# EAGLE design SparkFun_Differential_I2C_Breakout_PCA9615_Qwiic (EAGLE 9.6.0)
ABBREV: hb1; PROJECT: Heading Board
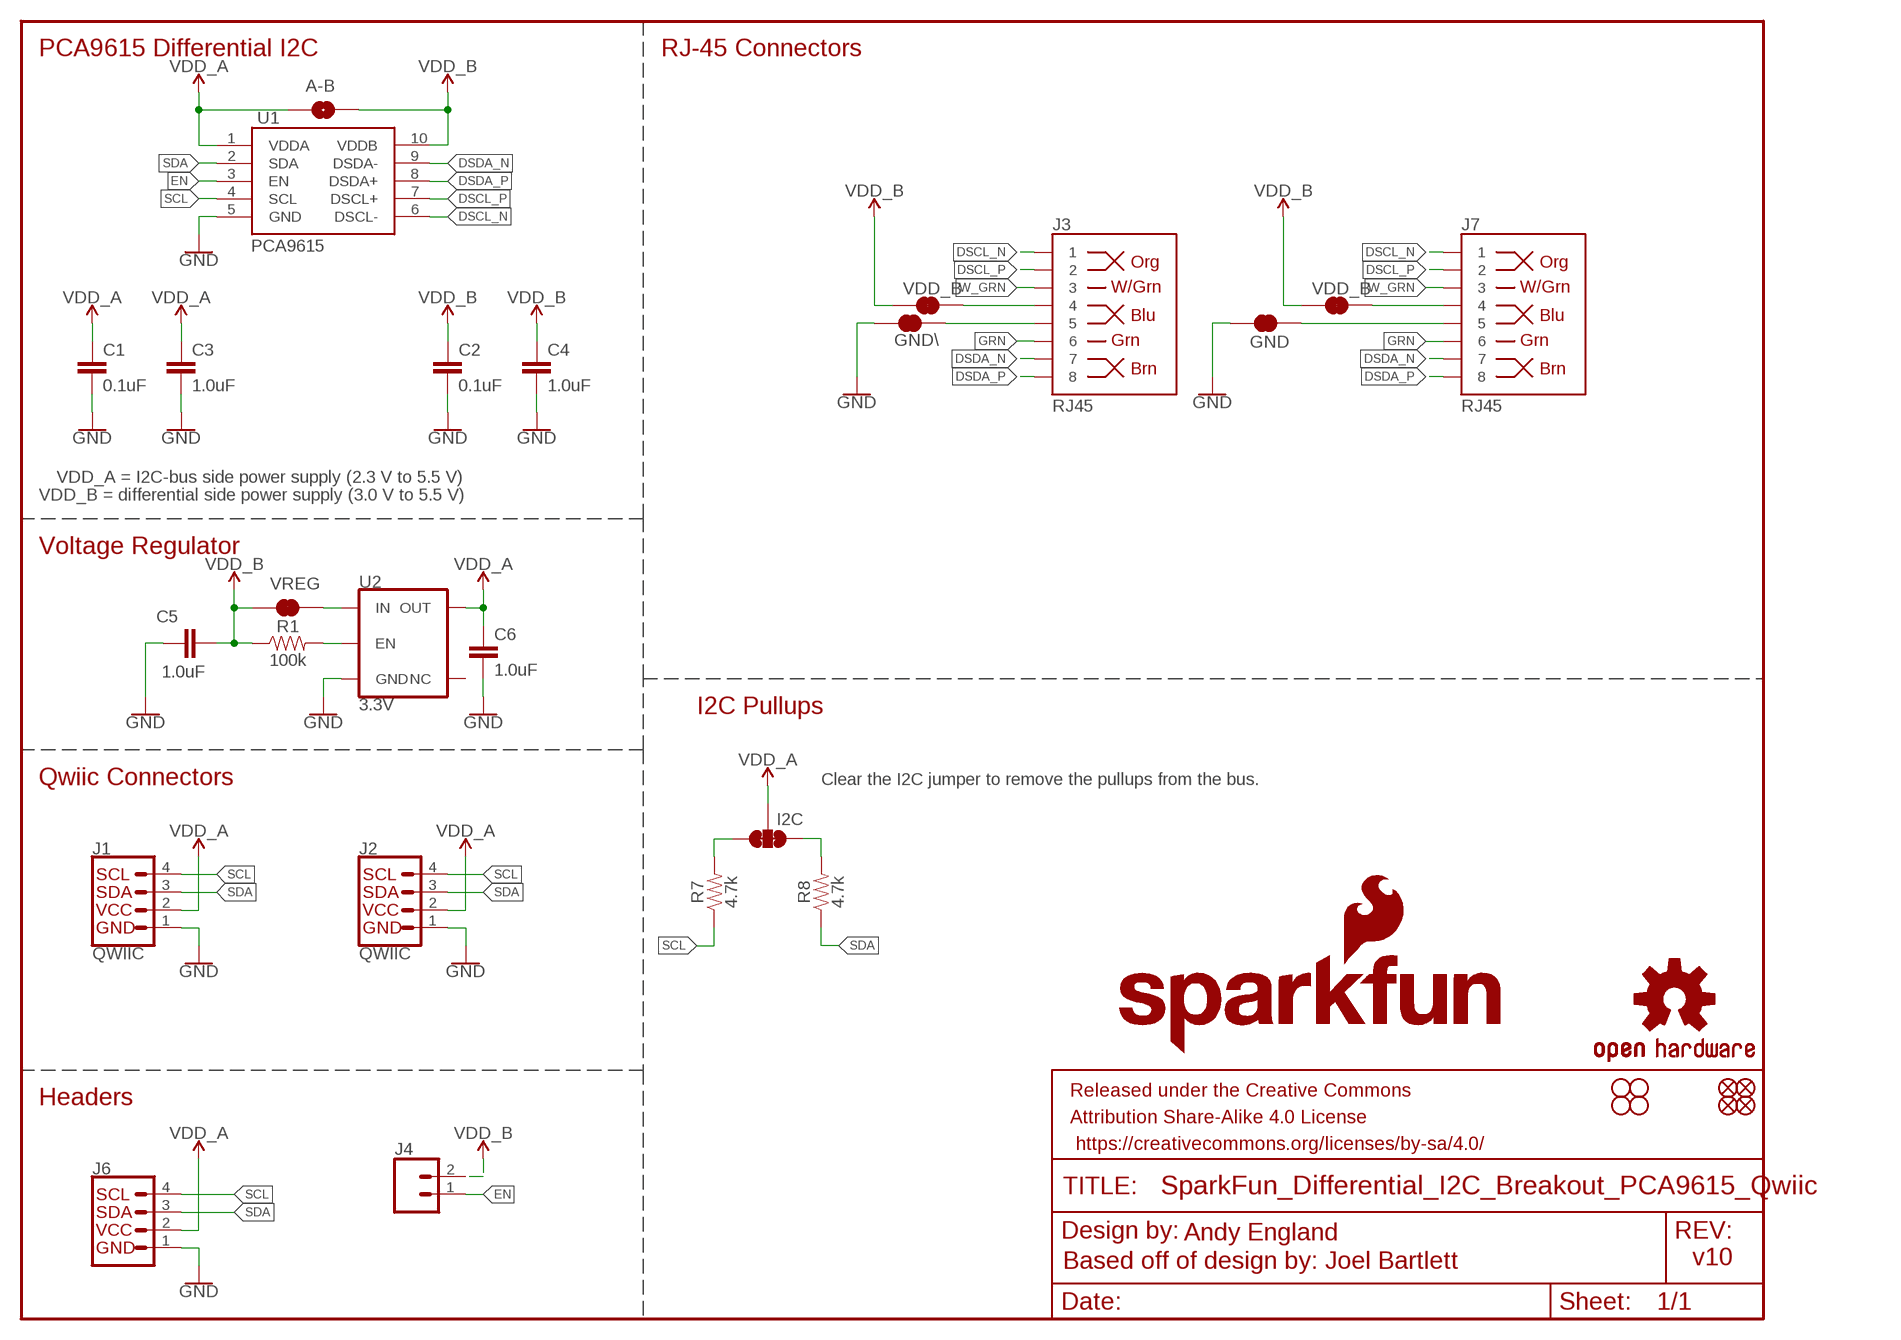
[diagram p0: schematic, sheet 1]

## Parts
A-B  JUMPER-SMT_2_NO_SILK  [SMT-JUMPER_2_NO_SILK]
C1  0.1uF  0.1UF-0603-25V-(+80/-20%)  [0603]
C2  0.1uF  0.1UF-0603-25V-(+80/-20%)  [0603]
C3  1.0uF  1.0UF-0603-16V-10%  [0603]
C4  1.0uF  1.0UF-0603-16V-10%  [0603]
C5  1.0uF  1.0UF-0603-16V-10%  [0603]
C6  1.0uF  1.0UF-0603-16V-10%  [0603]
FD1  FIDUCIALUFIDUCIAL  [FIDUCIAL-MICRO]
FD2  FIDUCIALUFIDUCIAL  [FIDUCIAL-MICRO]
FD3  FIDUCIALUFIDUCIAL  [FIDUCIAL-MICRO]
FD4  FIDUCIALUFIDUCIAL  [FIDUCIAL-MICRO]
FRAME1  FRAME-LETTER  [CREATIVE_COMMONS]
GND\  JUMPER-SMT_2_NC_TRACE_SILK  [SMT-JUMPER_2_NC_TRACE_SILK]
H1  STAND-OFF  [STAND-OFF]
H2  STAND-OFF  [STAND-OFF]
H3  STAND-OFF  [STAND-OFF]
H4  STAND-OFF  [STAND-OFF]
I2C  JUMPER-SMT_3_2-NC_TRACE_SILK  [SMT-JUMPER_3_2-NC_TRACE_SILK]
J1  QWIIC  QWIIC_CONNECTORJS-1MM  [JST04_1MM_RA]
J2  QWIIC  QWIIC_CONNECTORJS-1MM  [JST04_1MM_RA]
J3  RJ45  RJ45-8  [RJ45-8]
J4  CONN_021X02_NO_SILK  [1X02_NO_SILK]
J6  I2C_STANDARD_NO_SILK  [1X04_NO_SILK]
J7  RJ45  RJ45-8  [RJ45-8]
JP5  JUMPER-SMT_2_NC_TRACE_SILK  [SMT-JUMPER_2_NC_TRACE_SILK]
JP6  JUMPER-SMT_2_NC_TRACE_SILK  [SMT-JUMPER_2_NC_TRACE_SILK]
LOGO1  OSHW-LOGOM  [OSHW-LOGO-M]
LOGO5  SFE_LOGO_NAME_FLAME.1_INCH  [SFE_LOGO_NAME_FLAME_.1]
R1  100k  100KOHM-0603-1/10W-1%  [0603]
R7  4.7k  4.7KOHM-0603-1/10W-1%  [0603]
R8  4.7k  4.7KOHM-0603-1/10W-1%  [0603]
U1  PCA9615  [TSSOP10]
U2  3.3V  V_REG_AP2112K-3.3V  [SOT23-5]
VDD_B  JUMPER-SMT_2_NC_TRACE_SILK  [SMT-JUMPER_2_NC_TRACE_SILK]
VREG  JUMPER-SMT_2_NC_TRACE_SILK  [SMT-JUMPER_2_NC_TRACE_SILK]

## Nets
DSCL_N: J3.1 J7.1 U1.6(DSCL-)
DSCL_P: J3.2 J7.2 U1.7(DSCL+)
DSDA_N: J3.7 J7.7 U1.9(DSDA-)
DSDA_P: J3.8 J7.8 U1.8(DSDA+)
EN: J4.1 U1.3(EN)
GND: C1.2 C2.2 C3.2 C4.2 C5.1 C6.2 GND\.1 J1.1 J2.1 J6.1(GND) JP6.1 U1.5(GND) U2.2(GND)
GRN: J3.6 J7.6
N$1: J3.4 VDD_B.2
N$2: GND\.2 J3.5
N$3: I2C.1 R8.2
N$4: I2C.3 R7.2
N$5: J7.4 JP5.2
N$6: J7.5 JP6.2
N$7: R1.2 U2.3(EN)
N$8: U2.1(IN) VREG.2
SCL: J1.4 J2.4 J6.4(SCL) R7.1 U1.4(SCL)
SDA: J1.3 J2.3 J6.3(SDA) R8.1 U1.2(SDA)
VDD_A: A-B.1 C1.1 C3.1 C6.1 I2C.2 J1.2 J2.2 J6.2(VCC) U1.1(VDDA) U2.5(OUT)
VDD_B: A-B.2 C2.1 C4.1 C5.2 J4.2 JP5.1 R1.1 U1.10(VDDB) VDD_B.1 VREG.1
W_GRN: J3.3 J7.3
Unconnected: U2.4(NC)

## Notes on the sheet
- PCA9615 Differential I2C | RJ-45 Connectors
- VDD_B
- GND
- VDD_A = I2C-bus side power supply (2.3 V to 5.5 V)
- VDD_B = differential side power supply (3.0 V to 5.5 V)
- Voltage Regulator
- I2C Pullups
- Qwiic Connectors | Clear the I2C jumper to remove the pullups from the bus.
- Headers
- Andy England
- Based off of design by: Joel Bartlett | v10

## Library data of the parts
A-B = SparkFun-Jumpers:JUMPER-SMT_2_NO: Normally open jumper This jumper has two pads in close proximity to each other. Apply solder to close the connection. Round pads are easier to solder for beginners, but are a lot larger. SparkFun Product that uses the round pads: SparkFun EL Sequencer <https://www.sparkfun.com/products/12781>
C1 C2 = SparkFun-Capacitors:0.1UF: 0.1µF ceramic capacitors A capacitor is a passive two-terminal electrical component used to store electrical energy temporarily in an electric field.; PROD_ID: CAP-00810
C3-C6 = SparkFun-Capacitors:1.0UF: 1µF ceramic capacitors A capacitor is a passive two-terminal electrical component used to store electrical energy temporarily in an electric field.; PROD_ID: CAP-00868
FD1-FD4 = SparkFun-Aesthetics:FIDUCIAL: Fiducial Alignment Points Point-of-reference for pick-and-place machines and other optical instruments.
FRAME1 = SparkFun-Aesthetics:FRAME-LETTER: Schematic Frame - Letter Standard 8.5x11 US Letter frame
GND\ JP5 JP6 VDD_B VREG = SparkFun-Jumpers:JUMPER-SMT_2_NC_TRACE: Normally closed trace jumper This jumper has a trace between two pads so it's normally closed (NC). Use a razor knife to open the connection. For best results follow the IPC guidelines for cutting traces: Cutout at least 0.063 mm (0.005 in). Remove all loose material to clean up the cut area. Seal the cut with an approved epoxy. Reapply solder to reclose the connection.
H1-H4 = SparkFun-Hardware:STAND-OFF: Stand Off Drill holes for mechanically mounting via screws, standoffs, etc. Note: Use the keepout ring to avoid running the screw head into surrounding components. Variant Overviews STAND-OFF - Mechanical footprint for a #4 phillips button head screw. STAND-OFF-TIGHT - Mechanical footprint for a #4 phillips button head screw, Example SparkFun Products Screw - Phillips Head (1/4", 4-40, 10 pack) <https://www.sparkfun.com/products/10453> (PRT-10453) Screw - Phillips Head (1/2", 4-40, 10 pack) <https://www.sparkfun.com/products/10452> (PRT-10452) Screw - Phillips Head (3/4", 4-40, 10 pack) <https://www.sparkfun.com/products/10451> (PRT-10451) Screw - Phillips Head (1", 4-40, 10 pack) <https://www.sparkfun.com/products/10450> (PRT-10450)
I2C = SparkFun-Jumpers:JUMPER-SMT_3_2-NC_TRACE: Normally closed trace jumper (2 of 2 connections) This jumper has a trace between all three pads so they are normally closed (NC). Use a razor knife to open the connection(s). For best results follow the IPC guidelines for cutting traces: Cutout at least 0.063 mm (0.005 in). Remove all loose material to clean up the cut area. Seal the cut with an approved epoxy. Reapply solder to reclose the connection(s).
J1 J2 = SparkFun-Connectors:QWIIC_CONNECTOR: SparkFun I2C Standard Qwiic Connector An SMD 1mm pitch JST connector makes it easy and quick (get it? Qwiic?) to connect I2C devices to each other. The Qwiic system <http://www.sparkfun.com/qwiic> enables fast and solderless connection between popular platforms and various sensors and actuators. We carry 200mm <https://www.sparkfun.com/products/14204>, 100mm <https://www.sparkfun.com/products/14205>, 50mm <https://www.sparkfun.com/products/14206>, and breadboard friendly <https://www.sparkfun.com/products/14207> Qwiic cables. We also offer 10 pcs strips <https://www.sparkfun.com/products/14323> the SMD connectors.; PROD_ID: CONN-13694; VALUE: QWIIC_RIGHT_ANGLE
J3 J7 = SparkFun-Connectors:RJ45-8: RJ45 Jack - 8 pin Simple RJ45, 8-pin connection. Commonly used for Cat5, Cat5e, and Cat6 Ethernet cables. Here is the connector we sell at SparkFun: RJ45 8-Pin Connector <https://www.sparkfun.com/products/643> (PRT-00643) Datasheet <https://cdn.sparkfun.com/datasheets/Prototyping/04908.pdf> It is used on this SparkFun product: SparkFun RJ45 Breakout <https://www.sparkfun.com/products/716> (BOB-00716) Note, you may also be interested in the "MAGJACK" version of this. It is basically a RJ45 connector, but also has some status LEDs built into the connector housing. You can check that out in this library at the device named "MAGJACK.dev" and see these products online: RJ45 Ethernet MagJack-Compatible <https://www.sparkfun.com/products/8534> (PRT-08534) SparkFun RJ45 MagJack Breakout <https://www.sparkfun.com/products/13021> (BOB-13021); PROD_ID: CONN-08506; SF_ID: PRT-00643
J4 = SparkFun-Connectors:CONN_02: Multi connection point. Often used as Generic Header-pin footprint for 0.1 inch spaced/style header connections On any of the 0.1 inch spaced packages, you can populate with these: Break Away Headers - Straight <https://www.sparkfun.com/products/116> (PRT-00116) Break Away Male Headers - Right Angle <https://www.sparkfun.com/products/553> (PRT-00553) Female Headers <https://www.sparkfun.com/products/115> (PRT-00115) Break Away Headers - Machine Pin <https://www.sparkfun.com/products/117> (PRT-00117) Break Away Female Headers - Swiss Machine Pin <https://www.sparkfun.com/products/743> (PRT-00743) For SCREWTERMINALS and SPRING TERMINALS visit here: Screw Terimnals on SparkFun.com <https://www.sparkfun.com/search/results?term=Screw+Terminals> (5mm/3.5mm/2.54mm spacing) This device is also useful as a general connection point to wire up your design to another part of your project. Our various solder wires solder well into these plated through hole pads. Hook-Up Wire - Assortment (Stranded, 22 AWG) <https://www.sparkfun.com/products/11375> (PRT-11375) Hook-Up Wire - Assortment (Solid Core, 22 AWG) <https://www.sparkfun.com/products/11367> (PRT-11367) View the entire wire category on our website here <https://www.sparkfun.com/categories/141> Special notes: Molex polarized connector foot print use with: PRT-08233 with associated crimp pins and housings. 2.54_SCREWTERM for use with PRT-10571. 3.5mm Screw Terminal footprints for PRT-08084 5mm Screw Terminal footprints for use with PRT-08432
J6 = SparkX:I2C_STANDARD: SparkFun I2C Standard Pinout Header SparkFun has standardized on a pinout for all I2C based sensor breakouts. This pinout allows I2C boards to be plugged directly into the headers on Arduino Uno compatible boards, and to be daisy chained easily. Example SparkFun Products: SparkFun Atmospheric Sensor Breakout - BME280 <https://www.sparkfun.com/products/13676> SparkFun Altitude/Pressure Sensor Breakout - MPL3115A2 <https://www.sparkfun.com/products/11084> SparkFun TOF Range Finder Sensor - VL6180 <https://www.sparkfun.com/products/12785>
LOGO1 = SparkFun-Aesthetics:OSHW-LOGO: Open-Source Hardware (OSHW) Logo This logo indicates the piece of hardware it is found on incorporates a OSHW license and/or adheres to the definition of open source hardware found here: http://freedomdefined.org/OSHW
LOGO5 = SparkFun-Aesthetics:SFE_LOGO_NAME_FLAME: SparkFun Font Logo w/ Flame This is the SparkFun full logo. The logo on the schematic will always be the same size; the package variant is the height of the flame part of the logo. Default layer for the logo on the board is tSilk.
R1 = SparkFun-Resistors:100KOHM: 100kΩ resistor A resistor is a passive two-terminal electrical component that implements electrical resistance as a circuit element. Resistors act to reduce current flow, and, at the same time, act to lower voltage levels within circuits. - Wikipedia; PROD_ID: RES-07828
R7 R8 = SparkFun-Resistors:4.7KOHM: 4.7kΩ resistor A resistor is a passive two-terminal electrical component that implements electrical resistance as a circuit element. Resistors act to reduce current flow, and, at the same time, act to lower voltage levels within circuits. - Wikipedia; PROD_ID: RES-07857
U1 = SparkFun-IC-Comms:PCA9615: Differential I2C Bus Buffer Datasheet <https://www.nxp.com/docs/en/data-sheet/PCA9615.pdf>; PROD_ID: IC-13899
U2 = SparkFun-IC-Power:V_REG_AP2112: AP2112 - 600mA CMOS LDO Regulator w/ Enable The AP2112 is CMOS process low dropout linear regulator with enable function, the regulator delivers a guaranteed 600mA (min.) continuous load current. Features Output Voltage Accuracy: ±1.5% Output Current: 600mA (Min.) Foldback Short Current Protection: 50mA Enable Function to Turn ON/OFF VOUT Low Dropout Voltage (3.3V): 250mV (Typ.) @IOUT=600mA Excellent Load Regulation: 0.2%/A (Typ.) Excellent Line Regulation: 0.02%/V (Typ.) Low Quiescent Current: 55μA (Typ.) Low Standby Current: 0.01μA (Typ.) Low Output Noise: 50μVRMS PSRR: 100Hz -65dB, 1kHz -65dB OTSD Protection Stable with 1.0μF Flexible Cap: Ceramic, Tantalum and Aluminum Electrolytic Operation Temperature Range: -40°C to 85°C ESD: MM 400V, HBM 4000V; PROD_ID: VREG-12457

## Net classes
0 default: width 0.203 mm
1 power: width 0.381 mm, clearance 0.254 mm

## Board
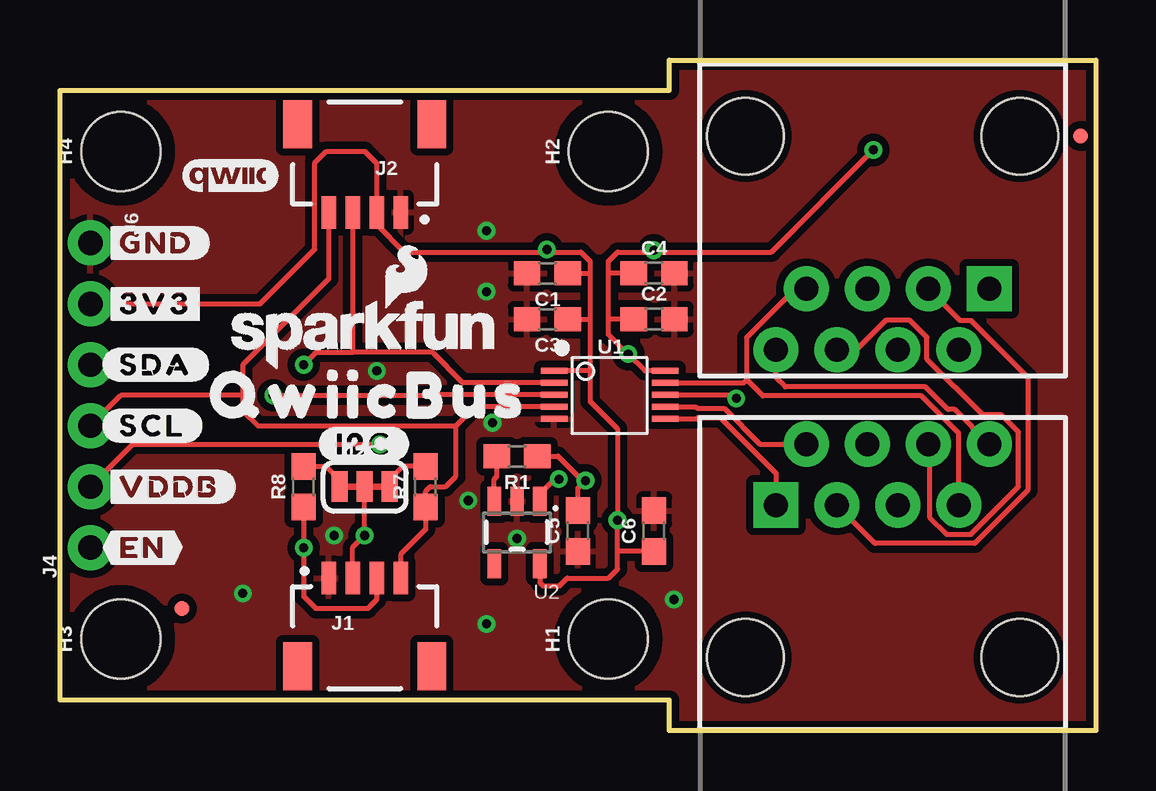
[diagram p1: board, top side]
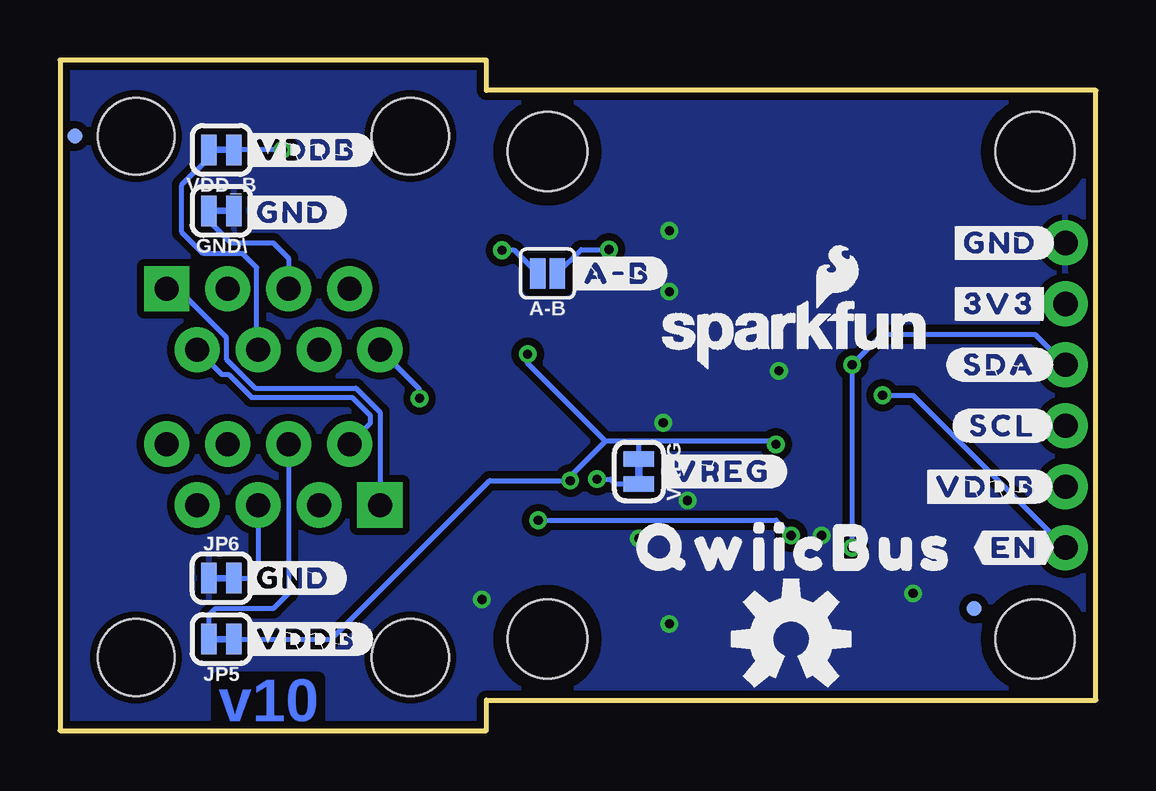
[diagram p2: board, bottom side, seen from below]

Size 43.18 x 27.94 mm. Coordinates in mm from the lower left corner, seen from the top.
Outline: 43.18,0 25.4,0 25.4,1.27 0,1.27 0,26.67 25.4,26.67 25.4,27.94 43.18,27.94 43.18,0
Copper layers (1*16): Top 0.035mm / dielectric 1.5mm / Bottom 0.035mm
Design rules "SparkFun-2-layer-TIGHT": minimum track width 7mil, minimum drill 15mil, track to track 7mil, track to pad 7mil, pad to pad 7mil, via to via 7mil, smd to smd 7mil, copper to edge 7mil, drill to drill 7mil, minimum pad ring 7mil, minimum via ring 7mil, stop-mask expansion 4mil, vias tented up to drill 25mil, thermal gap 10mil

### Footprints (pad centres in the part's own frame; a part is rotated, then mirrored left to right if it is on the bottom)
SMT-JUMPER_2_NO_SILK = smd 0.635 x 1.27: 1 -0.406,0; 2 0.406,0
0603 = smd 1.1 x 1: 1 -0.85,0; 2 0.85,0
FIDUCIAL-MICRO = smd 0.635 x 0.635: 1 0,0
SMT-JUMPER_2_NC_TRACE_SILK = smd 0.66 x 1.27: 1 -0.521,0; 2 0.521,0
STAND-OFF = hole 3.302: 0,0
SMT-JUMPER_3_2-NC_TRACE_SILK = smd 0.66 x 1.27: 1 -1.041,0; 2 0,0; 3 1.041,0
JST04_1MM_RA = smd 0.6 x 1.35: 1 -1.5,0; 2 -0.5,0; 3 0.5,0; 4 1.5,0 | smd 1.2 x 2: NC1 2.8,-3.675; NC2 -2.8,-3.675
RJ45-8 = drill 1 pad 1.88 square: 1 -4.445,6.35 | drill 1 pad 1.88: 2 -3.175,8.89; 3 -1.905,6.35; 4 -0.635,8.89; 5 0.635,6.35; 6 1.905,8.89; 7 3.175,6.35; 8 4.445,8.89 | hole 3.2: -5.715,0; 5.715,0
1X02_NO_SILK = drill 1.016 pad 1.88: 1 0,0; 2 2.54,0
1X04_NO_SILK = drill 1.016 pad 1.88: 1 0,0; 2 2.54,0; 3 5.08,0; 4 7.62,0
TSSOP10 = smd 1.1 x 0.25: 1 -2.259,1.018; 2 -2.259,0.517; 3 -2.259,0.018; 4 -2.259,-0.482; 5 -2.259,-0.988; 6 2.366,-0.988; 7 2.366,-0.482; 8 2.366,0.018; 9 2.366,0.517; 10 2.366,1.018
SOT23-5 = smd 0.55 x 1.2: 1 -0.95,-1.3; 2 0,-1.3; 3 0.95,-1.3; 4 0.95,1.3; 5 -0.95,1.3

### Placement (x,y rotation side)
A-B  22.86,19.05 180 bottom
C1  20.32,19.05 180 top
C2  24.77,17.14 0 top
C3  20.32,17.14 180 top
C4  24.77,19.05 0 top
C5  21.59,8.32 90 top
C6  24.77,8.32 90 top
FD1  5.08,5.08 0 top
FD2  42.55,24.77 0 top
FD3  5.08,5.08 0 bottom
FD4  42.55,24.77 0 bottom
FRAME1  -16.51,-15.24 0 top  (outside the outline)
GND\  36.45,21.65 180 bottom
H1  22.86,3.81 90 top
H2  22.86,24.13 90 top
H3  2.54,3.81 90 top
H4  2.54,24.13 90 top
I2C  12.7,10.16 0 top
J1  12.7,6.35 0 top
J2  12.7,21.59 180 top
J3  34.29,24.77 180 top
J4  1.27,7.62 90 top
J6  1.27,20.32 270 top
J7  34.29,3.05 0 top
JP5  36.45,3.81 180 bottom
JP6  36.45,6.35 0 bottom
LOGO1  12.7,3.81 0 bottom
LOGO2  SFE_LOGO_NAME_FLAME.1_INCH  [SFE_LOGO_NAME_FLAME_.1]  12.51,16.51 0 bottom
LOGO5  12.7,16.51 0 top
R1  19.05,11.43 180 top
R7  15.24,10.16 90 top
R8  10.16,10.16 90 top
U1  22.86,13.97 0 top
U2  19.05,8.26 180 top
U$1  [#GND#0]  1.78,20.32 0 top
U$2  [#3V3#0]  1.78,17.78 0 top
U$3  [#SDA#0]  1.78,15.24 0 top
U$4  [#SCL#0]  1.78,12.7 0 top
U$5  [#VDDB#0]  7.37,10.16 0 bottom
U$6  [#EN#0]  1.78,7.62 0 top
U$7  [#GND#0]  6.22,20.32 0 bottom
U$8  [#3V3#0]  6.22,17.78 0 bottom
U$9  [#SDA#0]  6.22,15.24 0 bottom
U$10  [#SCL#0]  5.97,12.7 0 bottom
U$11  [#A#B#0]  22.03,19.05 0 bottom
U$12  [#EN#0]  5.08,7.62 0 bottom
U$13  [#I2C#0]  10.79,11.94 0 top
U$14  [QWIICBUS0]  4.83,13.97 0 top
U$15  [QWIICBUS0]  20.57,7.62 0 bottom
U$16  [#VDDB#0]  1.78,10.16 0 top
U$17  [#VREG#0]  18.35,10.79 0 bottom
U$18  [#VDDB#0]  35.69,24.19 0 bottom
U$19  [#VDDB#0]  35.69,3.81 0 bottom
U$20  [#GND#0]  35.69,6.35 0 bottom
U$21  [#GND#0]  35.69,21.59 0 bottom
U$22  [QWIIC_4MM]  7.11,23.11 0 top
VDD_B  36.45,24.19 180 bottom
VREG  19.05,10.79 270 bottom

### Tracks (layer width: path | path; a pad name or v marks a point on that pad's centre or on a via)
DSCL_N
  Top 0.203: J7.1 29.84,10.73 27.54,13.04 26.57,13.04 26.52,12.98 U1.6
  Bottom 0.203: J7.1 29.84,13.27 30.84,14.27 35.04,14.27 36.25,15.47 36.25,16.38 38.28,18.41 J3.1
DSCL_P
  Top 0.203: J7.2 29.18,11.94 27.69,13.42 26.57,13.42 26.51,13.49 U1.7
  Bottom 0.203: J7.2 30.25,12.81 30.25,13.13 31,13.88 35.2,13.88 36.16,14.84 36.43,14.84 J3.2
DSDA_N
  Top 0.203: J3.7 30.66,18.41 28.63,16.38 28.63,14.62 | 28.63,14.62 29.3,13.94 35.91,13.94 37.47,12.39 J7.7 | U1.9 28.5,14.49 28.63,14.62
DSDA_P  (via drill 0.38)
  Top 0.203: J3.8 29.84,14.71 30.23,14.32 36.07,14.32 37.02,13.38 37.29,13.38 J7.8 | U1.8 28.04,13.99 v28.19,13.84
  Bottom 0.203: v28.19,13.84 28.19,14.22 J3.8
EN  (via drill 0.38)
  Top 0.203: U1.3 15.26,13.99 15.24,13.97 v8.89,13.97
  Bottom 0.203: v8.89,13.97 7.62,13.97 J4.1
GND  (via drill 0.38)
  other vias: 11.43,8.13 17.78,18.29 19.05,8 18.03,12.83 17.78,4.45 7.62,5.71 13.21,14.99 17.02,9.59 17.78,20.83 25.59,5.46
  pour Top (isolate 0.305): 43.18,0 25.4,0 25.4,1.27 0,1.27 0,26.67 25.4,26.67 25.4,27.94 43.18,27.94
  pour Bottom (isolate 0.305): 43.18,0 25.4,0 25.4,1.27 0,1.27 0,26.67 25.4,26.67 25.4,27.94 43.18,27.94
  pour Bottom (isolate 0.305): 43.18,0 25.4,0 25.4,1.27 0,1.27 0,26.67 25.4,26.67 25.4,27.94 43.18,27.94
GRN
  Top 0.203: J7.6 36.25,11.89 36.25,8.89 36.96,8.18 37.97,8.18 39.95,10.16 39.95,12.44 39.24,13.16 38.46,13.16 36.14,15.47 36.14,16.38 35.43,17.09 34.42,17.09 33.2,15.88 J3.6
N$1
  Bottom 0.203: J3.4 34.98,15.93 34.98,19.29 35.56,19.88 37.21,19.88 38.1,20.77 38.1,22.73 36.97,23.86 VDD_B.2
N$2
  Bottom 0.203: GND\.2 36.97,21.22 36.07,20.32 34.29,20.32 33.66,19.68 J3.5
N$3
  Top 0.203: R8.2 11.09,11.01 11.68,10.41 11.66,10.39 I2C.1
N$4
  Top 0.203: R7.2 14.31,11.01 13.72,10.41 13.74,10.39 I2C.3
N$5
  Bottom 0.203: J7.4 33.66,5.71 34.29,5.08 36.7,5.08 36.96,4.83 36.96,3.82 JP5.2
N$6
  Bottom 0.203: J7.5 34.92,6.73 35.31,6.35 JP6.2
N$7
  Top 0.203: R1.2 18.2,10.58 18.1,10.48 U2.3
N$8  (via drill 0.38)
  Top 0.203: v20.8,10.48 20.61,10.48 20,9.87 U2.1
  Bottom 0.203: v20.8,10.48 20.23,10.48 20.04,10.29 19.06,10.29 VREG.2
SCL
  Top 0.203: J1.4 14.2,7.34 15.24,8.38 R7.1 15.24,9.97 15.43,10.16 16.07,10.16 16.51,10.6 16.51,12.7 | U1.4 17.3,13.49 16.51,12.7 | 7.62,13.97 2.54,13.97 J6.4 | 7.62,13.97 7.62,13.34 8.26,12.7 16.51,12.7 | J2.4 11.2,18.82 7.62,15.24 7.62,13.97
SDA  (via drill 0.38)
  Top 0.203: R8.1 v10.16,7.62 10.16,5.59 10.67,5.08 12.83,5.08 13.2,5.45 J1.3 | U1.2 16.79,14.49 15.52,15.76 12.19,15.76 | v10.16,15.24 10.68,15.76 12.19,15.76 | J2.3 12.2,15.77 12.19,15.76
  Bottom 0.203: v10.16,7.62 v10.16,15.24 8.89,16.51 2.54,16.51 J6.3
VDD_A  (via drill 0.38)
  Top 0.203: J1.2 12.2,7.63 v12.7,8.13 I2C.2 | 22.1,14.99 U1.1 | 20.26,19.94 14.35,19.94 13.2,21.09 J2.2 13.2,23.63 12.7,24.13 11.1,24.13 10.62,23.65 10.62,20.05 8.35,17.78 J6.2 | 20.26,19.94 21.72,19.94 22.1,19.56 22.1,19.05 | 22.1,19.05 22.1,17.14 | C3.1 22.1,17.14 | C1.1 22.1,19.05 | 22.1,17.14 22.1,14.99 | 22.1,14.99 22.1,13.72 23.24,12.57 v23.24,8.76 23.24,7.43 | 23.24,7.43 23.24,6.73 22.86,6.35 21.14,6.35 20.83,6.03 20.13,6.03 20,6.16 U2.5 | C6.1 23.28,7.47 23.24,7.43 | v20.3,20.04 20.3,19.98 20.26,19.94
  Bottom 0.203: v23.24,8.76 13.34,8.76 v12.7,8.13 | A-B.1 21.46,20.04 v20.3,20.04
VDD_B  (via drill 0.38)
  Top 0.203: U1.10 24.38,14.99 v23.69,15.68 22.86,16.51 22.86,17.14 | 24.77,19.94 23.24,19.94 22.86,19.56 22.86,19.05 | 24.77,19.94 29.65,19.94 v33.91,24.19 | 22.86,17.14 22.86,19.05 | C2.1 22.86,17.14 | C4.1 22.86,19.05 | R1.1 20.77,11.43 21.78,10.41 v21.91,10.41 21.59,10.1 C5.2 | J4.2 3.04,11.93 v13.34,11.93 | v24.75,20.01 v24.77,20 24.77,19.94
  Bottom 0.203: v33.91,24.19 VDD_B.1 | JP5.1 31.88,3.81 25.27,10.41 v21.91,10.41 21.91,10.6 20.45,12.06 | v23.69,15.68 23.69,15.3 20.45,12.06 | v13.34,11.93 13.47,12.06 19.05,12.06 | 19.05,12.06 20.45,12.06 | A-B.2 24.23,20.01 v24.75,20.01 | VREG.1 19.05,12.06
W_GRN
  Top 0.203: J3.3 37.52,17.09 37.97,17.09 40.34,14.73 40.34,10.01 38.13,7.8 33.98,7.8 32.38,9.39 J7.3

### Text on the board
Bottom: v10
Measures: Units in Inches
tDocu: Andy England | Based on a design by: Joel Bartlett